# Altium schematic sheet Actuator.SchDoc: Set in Document Options » Parameters » Title
size Tabloid; Author: Set in Document Options » Parameters » Author + Contact info
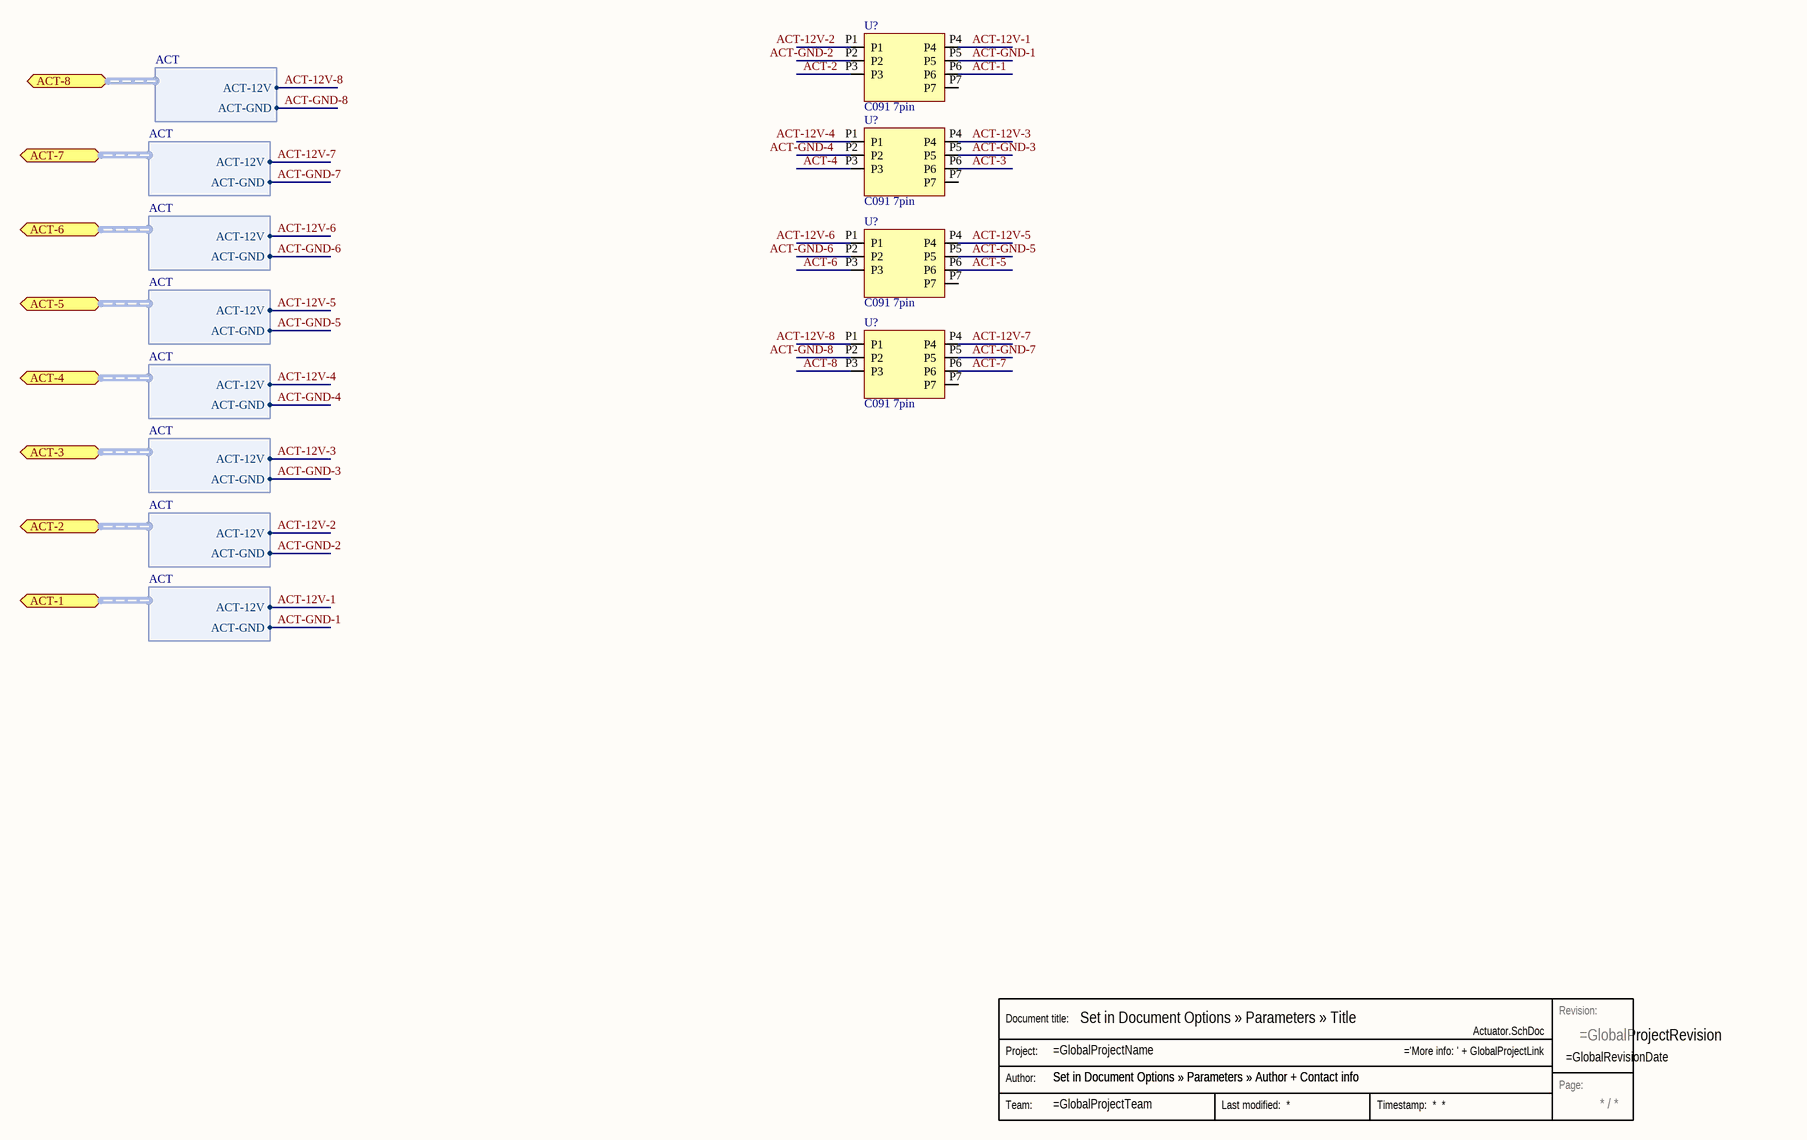
[diagram p0: Actuator.SchDoc]

## Parts
(Parts that share a designator on the sheet are numbered #1, #2 ... from top to bottom, then left to right.)
Stamp  Stamp  (value not drawn)  (graphical)
U?#1  C091 7pin
U?#2  C091 7pin
U?#3  C091 7pin
U?#4  C091 7pin

## Ports
ACT-1 (harness ACT), ACT-2 (harness ACT), ACT-3 (harness ACT), ACT-4 (harness ACT), ACT-5 (harness ACT), ACT-6 (harness ACT), ACT-7 (harness ACT), ACT-8 (harness ACT)

## Harnesses
ACT: ACT-GND, ACT-12V

## Nets
ACT-1: U?#1.P6
ACT-2: U?#1.P3
ACT-3: U?#2.P6
ACT-4: U?#2.P3
ACT-5: U?#3.P6
ACT-6: U?#3.P3
ACT-7: U?#4.P6
ACT-8: U?#4.P3
ACT-12V-1: U?#1.P4 ; port ACT-1.ACT-12V
ACT-12V-2: port ACT-2.ACT-12V
ACT-12V-3: U?#2.P4 ; port ACT-3.ACT-12V
ACT-12V-4: port ACT-4.ACT-12V
ACT-12V-5: U?#3.P4 ; port ACT-5.ACT-12V
ACT-12V-6: port ACT-6.ACT-12V
ACT-12V-7: U?#4.P4 ; port ACT-7.ACT-12V
ACT-12V-8: port ACT-8.ACT-12V
ACT-GND-1: U?#1.P5 ; port ACT-1.ACT-GND
ACT-GND-2: port ACT-2.ACT-GND
ACT-GND-3: U?#2.P5 ; port ACT-3.ACT-GND
ACT-GND-4: port ACT-4.ACT-GND
ACT-GND-5: U?#3.P5 ; port ACT-5.ACT-GND
ACT-GND-6: port ACT-6.ACT-GND
ACT-GND-7: U?#4.P5 ; port ACT-7.ACT-GND
ACT-GND-8: port ACT-8.ACT-GND

Not connected (* = marked no-connect by the designer): U?#1 P1 P2 P7; U?#2 P1 P2 P7; U?#3 P1 P2 P7; U?#4 P1 P2 P7

## Notes on the sheet
- Labels drawn without touching a wire or pin: ACT-12V-2, ACT-12V-4, ACT-12V-6, ACT-12V-8, ACT-GND-2, ACT-GND-4, ACT-GND-6, ACT-GND-8
- (in symbol Stamp) Revision:; Document title:; Project:; Author:; Page:; Team:

## Library data of the parts
U?#1-U?#4 = 7 pin connector